# Altium project var-dt8m-dbgc-ext.PrjPcb
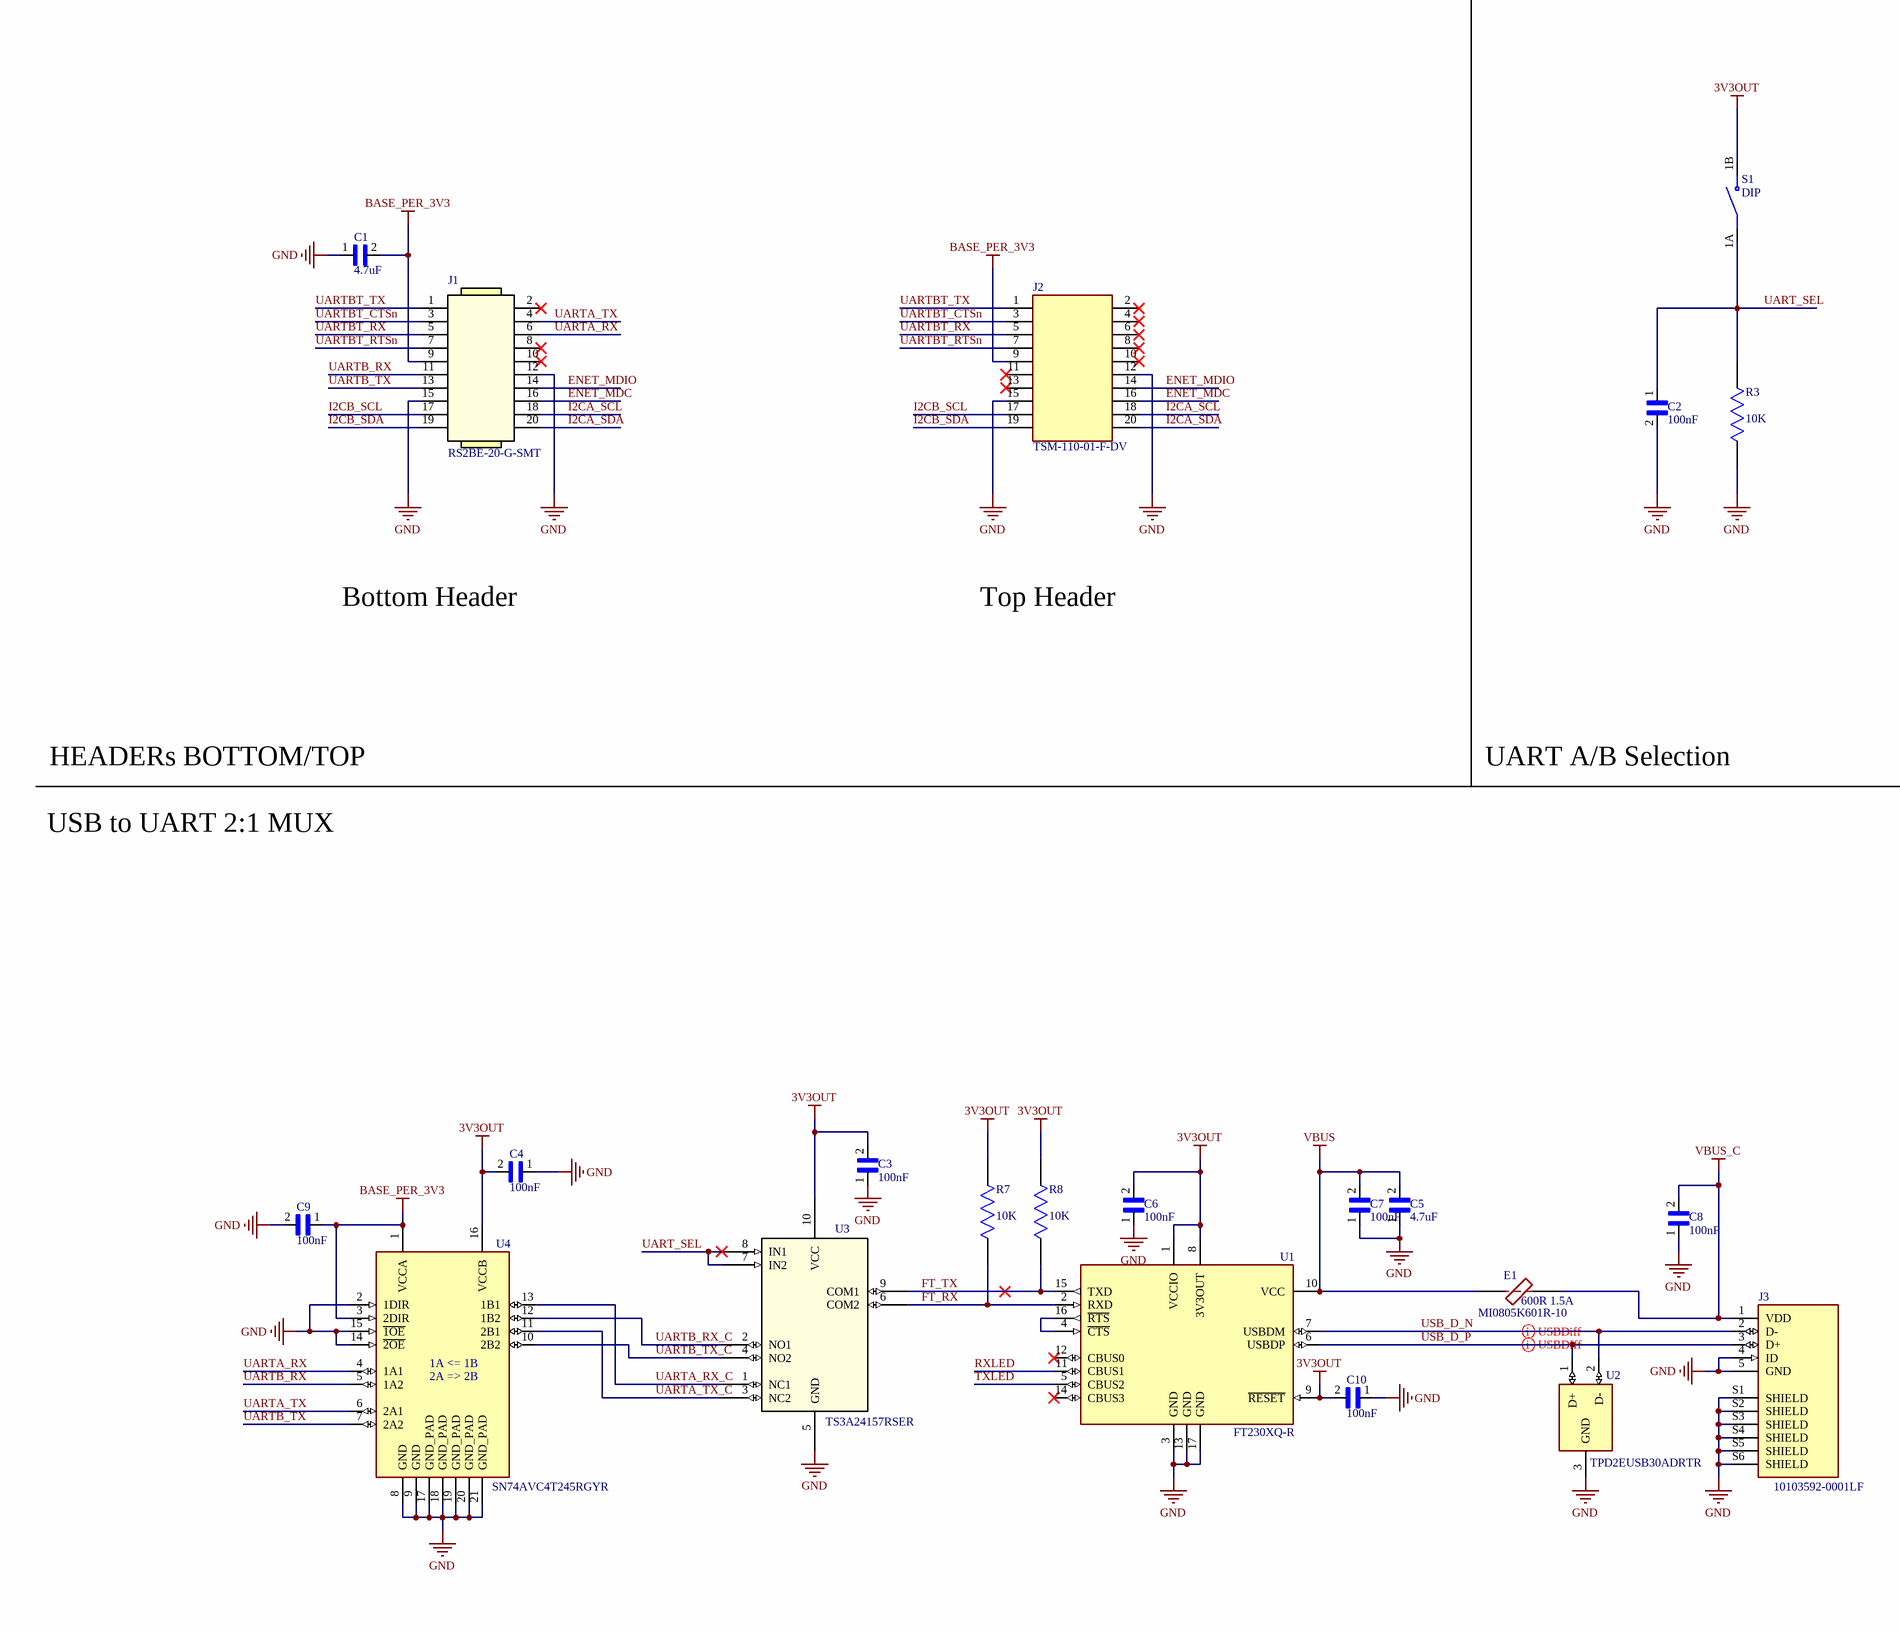
[diagram p0: ExtensionBoard.SchDoc, left]
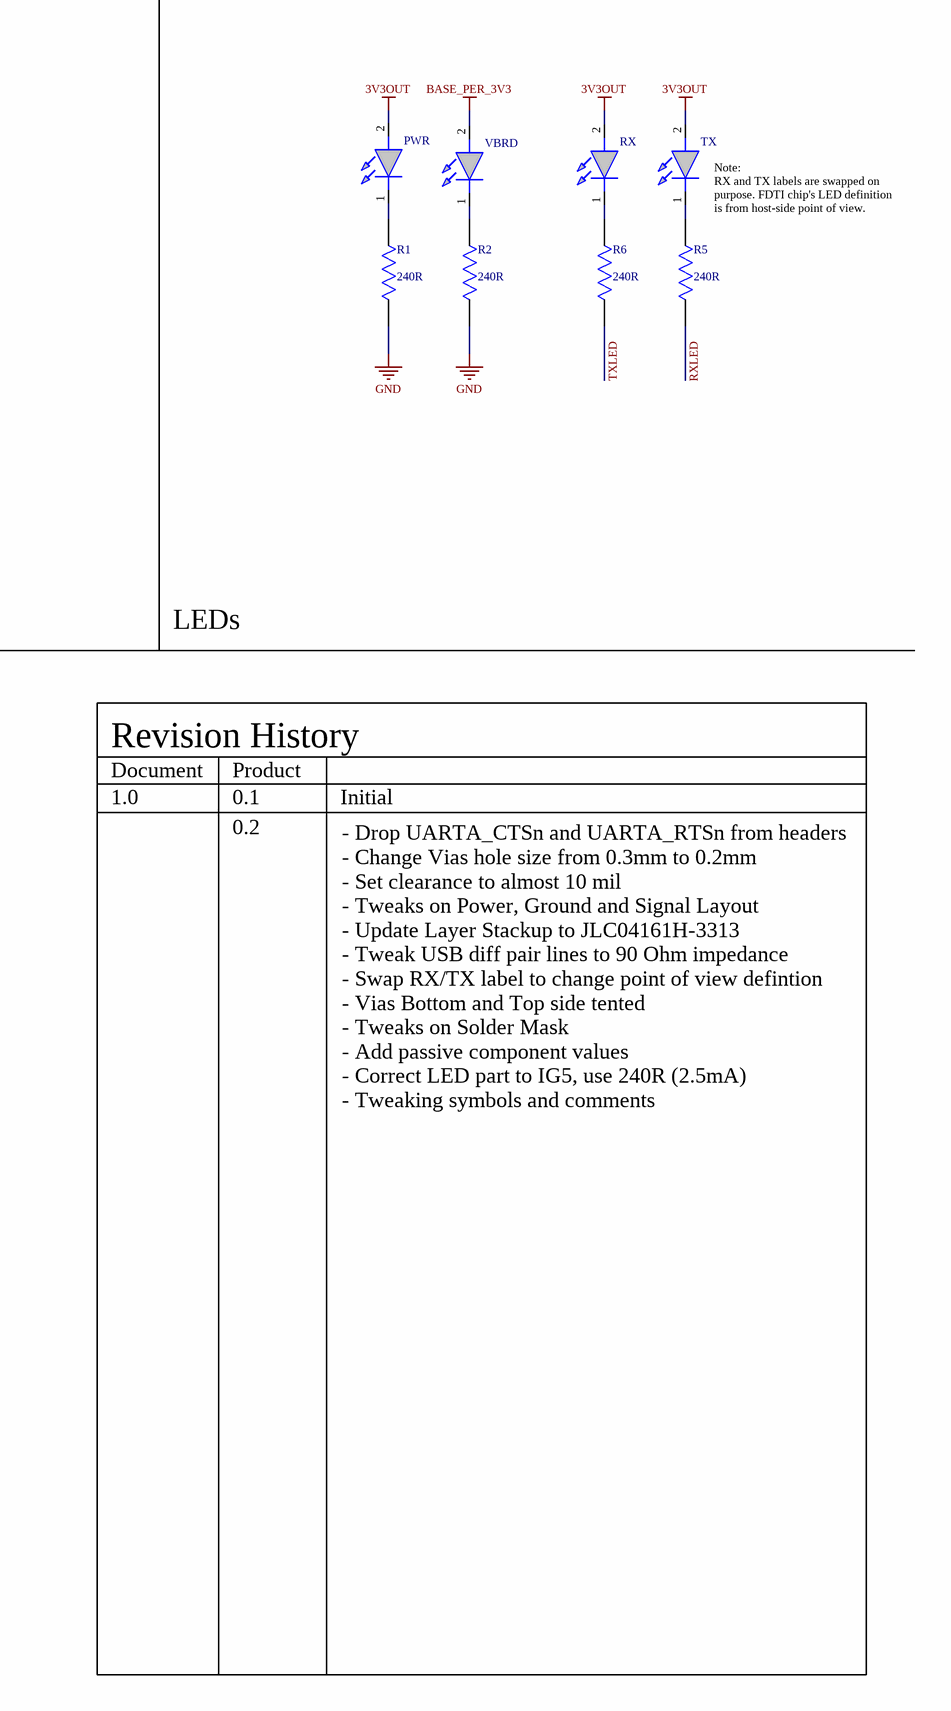
[diagram p1: ExtensionBoard.SchDoc, right]
1 sheet, 30 parts. Net scope: global (net labels, ports and power ports of the same name join across sheets).
Board file: ExtensionBoard.PcbDoc

## Sheet ExtensionBoard.SchDoc: VAR-DT8M-DBGC-EXT
size A2; Author: Alexander H.; DrawnBy: Alexander H.; Revision: 0.2; SheetNumber: 1; SheetTotal: 1

### Parts
C1  value 4.7uF  [CAPC1608X90N]  (hidden comment: LMK107BJ475KAHT)
C2  value 100nF  [CAPC1608X90N]  (hidden comment: 0603YC104K4T4A)
C3  value 100nF  [CAPC1608X90N]  (hidden comment: 0603YC104K4T4A)
C4  value 100nF  [CAPC1608X90N]  (hidden comment: 0603YC104K4T4A)
C5  value 4.7uF  [CAPC1608X90N]  (hidden comment: LMK107BJ475KAHT)
C6  value 100nF  [CAPC1608X90N]  (hidden comment: 0603YC104K4T4A)
C7  value 100nF  [CAPC1608X90N]  (hidden comment: 0603YC104K4T4A)
C8  value 100nF  [CAPC1608X90N]  (hidden comment: 0603YC104K4T4A)
C9  value 100nF  [CAPC1608X90N]  (hidden comment: 0603YC104K4T4A)
C10  value 100nF  [CAPC1608X90N]  (hidden comment: 0603YC104K4T4A)
E1  MI0805K601R-10  value 600R 1.5A  [FB_MI0805K601R-10]
J1  RS2BE-20-G-SMT  [CONN_RS2BE-20-G-SMT_ADM]
J2  TSM-110-01-F-DV  [SAMTEC_TSM-110-01-F-DV]
J3  10103592-0001LF  [AMPHENOL_10103592-0001LF]
PWR  QBL595-IG5  [LED 0402_1005 GREEN]  (value not drawn)
R1  value 240R  [RESC1508X55N]  (hidden comment: RMCF0603JT240R)
R2  value 240R  [RESC1508X55N]  (hidden comment: RMCF0603JT240R)
R3  value 10K  [RESC1508X55N]  (hidden comment: RMCF0603JT10K0)
R5  value 240R  [RESC1508X55N]  (hidden comment: RMCF0603JT240R)
R6  value 240R  [RESC1508X55N]  (hidden comment: RMCF0603JT240R)
R7  value 10K  [RESC1508X55N]  (hidden comment: RMCF0603JT10K0)
R8  value 10K  [RESC1508X55N]  (hidden comment: RMCF0603JT10K0)
RX  QBL595-IG5  [LED 0402_1005 GREEN]  (value not drawn)
S1  value DIP  [SW_DS04-254-2-01BK-SMT]  (hidden comment: DS04-254-2-01BK-SMT)
TX  QBL595-IG5  [LED 0402_1005 GREEN]  (value not drawn)
U1  FT230XQ-R  [QFN65P400X400X80-17N]
U2  TPD2EUSB30ADRTR  [SOTFL35P100X50-3N]
U3  TS3A24157RSER  [RSE10]
U4  SN74AVC4T245RGYR  [QFN50P400X350X100-17N]
VBRD  QBL595-IG5  [LED 0402_1005 GREEN]  (value not drawn)

### Nets
3V3OUT: C3.2 C4.2 C6.2 C10.2 PWR.2(A) R7.2 R8.2 RX.2(A) S1.1B(NO) TX.2(A) U1.1(VCCIO) U1.8(3V3OUT) U1.9(~{RESET}) U3.10(VCC) U4.16(VCCB)
BASE_PER_3V3: C1.2 C9.1 J1.9 J2.9 U4.1(VCCA) U4.3(2DIR) VBRD.2(A)
GND: C1.1 C2.2 C3.1 C4.1 C5.1 C6.1 C7.1 C8.1 C9.2 C10.1 J1.12 J1.15 J2.12 J2.15 J3.4(ID) J3.5(GND) J3.S1(SHIELD) J3.S2(SHIELD) J3.S3(SHIELD) J3.S4(SHIELD) J3.S5(SHIELD) J3.S6(SHIELD) R1.1 R2.1 R3.1 U1.3(GND) U1.13(GND) U1.17(GND) U2.3(GND) U3.5(GND) U4.2(1DIR) U4.8(GND) U4.9(GND) U4.14(~{2OE}) U4.15(~{1OE}) U4.17(GND_PAD) U4.18(GND_PAD) U4.19(GND_PAD) U4.20(GND_PAD) U4.21(GND_PAD)
VBUS: C5.2 C7.2 E1.1 U1.10(VCC)
VBUS_C: C8.2 E1.2 J3.1(VDD)
ENET_MDC: J1.16 J2.16
ENET_MDIO: J1.14 J2.14
FT_RX: R7.1 U1.2(RXD) U3.6(COM2)
FT_TX: R8.1 U1.15(TXD) U3.9(COM1)
I2CA_SCL: J1.18 J2.18
I2CA_SDA: J1.20 J2.20
I2CB_SCL: J1.17 J2.17
I2CB_SDA: J1.19 J2.19
RXLED: R5.2 U1.11(CBUS1)
TXLED: R6.2 U1.5(CBUS2)
UART_SEL: C2.1 R3.2 S1.1A(COM) U3.7(IN2) U3.8(IN1)
UARTA_RX: J1.6 U4.4(1A1)
UARTA_RX_C: U3.1(NC1) U4.13(1B1)
UARTA_TX: J1.4 U4.6(2A1)
UARTA_TX_C: U3.3(NC2) U4.11(2B1)
UARTB_RX: J1.11 U4.5(1A2)
UARTB_RX_C: U3.2(NO1) U4.12(1B2)
UARTB_TX: J1.13 U4.7(2A2)
UARTB_TX_C: U3.4(NO2) U4.10(2B2)
UARTBT_CTSn: J1.3 J2.3
UARTBT_RTSn: J1.7 J2.7
UARTBT_RX: J1.5 J2.5
UARTBT_TX: J1.1 J2.1
USB_D_N: J3.2(D-) U1.7(USBDM) U2.2(D-)
USB_D_P: J3.3(D+) U1.6(USBDP) U2.1(D+)
NetPWR_1: PWR.1(K) R1.2
NetR2_2: R2.2 VBRD.1(K)
NetR5_1: R5.1 TX.1(K)
NetR6_1: R6.1 RX.1(K)
NetU1_4: U1.4(~{CTS}) U1.16(~{RTS})

Not connected (* = marked no-connect by the designer): J1 2* 8* 10*; J2 2* 4* 6* 8* 10* 11* 13*; U1 12(CBUS0)* 14(CBUS3)*

### Layout directives
differential pair; differential pair class USB_D: USB_D_N, USB_D_P

### Notes on the sheet
- Note:
  RX and TX labels are swapped on purpose. FDTI chip's LED definition is from host-side point of view.
- Bottom Header
- Top Header
- HEADERs BOTTOM/TOP
- UART A/B Selection
- LEDs
- USB to UART 2:1 MUX
- Revision History
- Document
- 1.0
- Product
- 0.1
- Initial
- 0.2
- (near U4) 2A => 2B
- (near U4) 1A <= 1B
- - Drop UARTA_CTSn and UARTA_RTSn from headers
  - Change Vias hole size from 0.3mm to 0.2mm
  - Set clearance to almost 10 mil
  - Tweaks on Power, Ground and Signal Layout
  - Update Layer Stackup to JLC04161H-3313
  - Tweak USB diff pair lines to 90 Ohm impedance
  - Swap RX/TX label to change point of view defintion
  - Vias Bottom and Top side tented
  - Tweaks on Solder Mask
  - Add passive component values
  - Correct LED part to IG5, use 240R (2.5mA)
  - Tweaking symbols and comments

### Library data of the parts
C1 C5 = LMK107BJ475KAHT: CAPACITOR, MLCC, X5R, 4.7UF, 10V, 0603, REEL, FULL REEL; Package: None; Price: None; MP: LMK107BJ475KAHT; Availability: Unavailable
C2-C4 C6-C10 = 0603YC104K4T4A: Cap Ceramic 0.1uF 16V X7R 10% SMD 0603 125ÂÂŽ Paper T/R; Package: None; Price: None; MP: 0603YC104K4T4A; Availability: Unavailable
E1 = MI0805K601R-10: 600 Ohms @ 100MHz 1 Power Line Ferrite Bead 0805 (2012 Metric) 1.5A 100mOhm; MF: Laird-Signal Integrity; Price: None; SnapEDA_Link: https://www.snapeda.com/parts/MI0805K601R-10/Laird-Signal%20Integrity%20Products/view-part/332699/?ref=snap; Purchase-URL: https://pricing.snapeda.com/search/part/MI0805K601R-10/?ref=eda; MP: MI0805K601R-10; Availability: Warning; Package: 0805 Laird; Check_prices: https://www.snapeda.com/parts/MI0805K601R-10/Laird-Signal%20Integrity%20Products/view-part/332699/?ref=eda
J1 = RS2BE-20-G-SMT: No Description Available; Mfr_Name: ADAM TECHNOLOGIES INC; Type: Headers, Receptacles, Female Sockets; RefDes: RefDes
J2 = TSM-110-01-F-DV: MF: Samtec; Value: *; Price: None; Package: None; Availability: Unavailable; MP: TSM-110-01-F-DV
J3 = 10103592-0001LF: Micro USB 2.0, Input Output Connectors, B TYPE REVERSE; MF: Amphenol ICC; Check_prices: https://www.snapeda.com/parts/10103592-0001LF/Amphenol+FCI/view-part/?ref=eda; Digi-Key_Part_Number: 609-4048-2-ND; Value: *; SnapEDA_Link: https://www.snapeda.com/parts/10103592-0001LF/Amphenol+FCI/view-part/?ref=snap; Package: None; MP: 10103592-0001LF; Purchase-URL: https://pricing.snapeda.com/search/part/10103592-0001LF/?ref=eda
PWR RX TX VBRD = QBL595-IG5: LED Green Clear 0402 SMD
R1 R2 R5 R6 = RMCF0603JT10K0: Package: None; Price: None; MP: RMCF0603JT10K0; Availability: Unavailable
S1 = DS04-254-2-01BK-SMT: 1 Position, Surface Mount, 2.54 mm Pitch, Flat Slide Actuator, Flat Bottom, SMT Pin, DIP Switch; MF: CUI Devices; Price: None; MP: DS04-254-2-01BK-SMT; Purchase-URL: https://pricing.snapeda.com/search/part/DS04-254-2-01BK-SMT/?ref=eda; Package: None; Check_prices: https://www.snapeda.com/parts/DS04-254-2-01BK-SMT/CUI+Devices/view-part/?ref=eda; SnapEDA_Link: https://www.snapeda.com/parts/DS04-254-2-01BK-SMT/CUI+Devices/view-part/?ref=snap; Availability: In Stock; CUI_purchase_URL: https://www.cuidevices.com/product/switches/dip-switches/ds04-254-smt-series?utm_source=snapeda.com&utm_medium=referral&utm_campaign=snapedaBOM
U1 = FT230XQ-R: USB Bridge, USB to UART USB 2.0 UART Interface 16-QFN (4x4); MF: FTDI,; Availability: Unavailable; Value: *; DigiKey-Purchase-URL: https://snapeda.com/shop?store=DigiKey&id=51347; Package: QFN-16 FTDI; Price: None; MP: FT230XQ-R; SnapEDA_Link: https://www.snapeda.com/parts/FT230XQ-R/FTDI,%20Future%20Technology%20Devices%20International%20Ltd/view-part/51347/?ref=snap
U2 = TPD2EUSB30ADRTR: 2-Channel ESD/Surge Solution for High-Speed Low-Voltage Interface; MF: Texas Instruments; DigiKey-Purchase-URL: https://snapeda.com/shop?store=DigiKey&id=186330; Texas_Instruments-Purchase-URL: https://snapeda.com/shop?store=Texas+Instruments&id=186330; Mouser-Purchase-URL: https://snapeda.com/shop?store=Mouser&id=186330; Value: *; Arrow_Electronics-Purchase-URL: https://snapeda.com/shop?store=Arrow+Electronics&id=186330; Price: None; Availability: Unavailable; Package: SOT-9X3-3 Texas Instruments; SnapEDA_Link: https://www.snapeda.com/parts/TPD2EUSB30ADRTR/Texas%20Instruments/view-part/186330/?ref=snap; MP: TPD2EUSB30ADRTR
U3 = TS3A24157RSER: No Description Available; Mfr_Name: Texas Instruments; RefDes: RefDes; Type: Type
U4 = SN74AVC4T245RGYR: 4-Bit Dual-Supply Bus Transceiver with Configurable Voltage-Level Shifting and 3-State Outputs 16-VQFN -40 to 85; Package: None; Value: *; MP: SN74AVC4T245RGYR; Availability: Unavailable; Price: None
R3 R7 R8 = RMCF0603JT10K0: Package: None; Price: None; MP: RMCF0603JT10K0; Availability: Unavailable